# Altium project SAML21_Xplained_Pro.PrjPCB (part 2 of 3)

## Sheet SAML21_Xplained_Pro_triple_input_power_supply.SchDoc: Power supply
size A3; Organization: ATMEL Norway; Address1: Vestre Rosten 79; Address2: N-7075 TILLER; Address3: NORWAY; DocumentNumber: A09-2241; Revision: 4; SheetNumber: 5; SheetTotal: 10; PageSetup: Record=PageOptions|CenterHorizontal=True|CenterVertical=True|PrintScale=1.01|XCorrection=1.00|YCorrection=1.00|PrintKind=1|BorderSize=5000000|LeftOffset=0|BottomOffset=0|Orientation=2|PaperLength=1000|PaperWidth=1000|Scale=100|PaperSource=7|PrintQuality=-4|MediaType=1|DitherType=10|PaperKind=A3 (297 x 420 mm)|PrintScaleMode=1
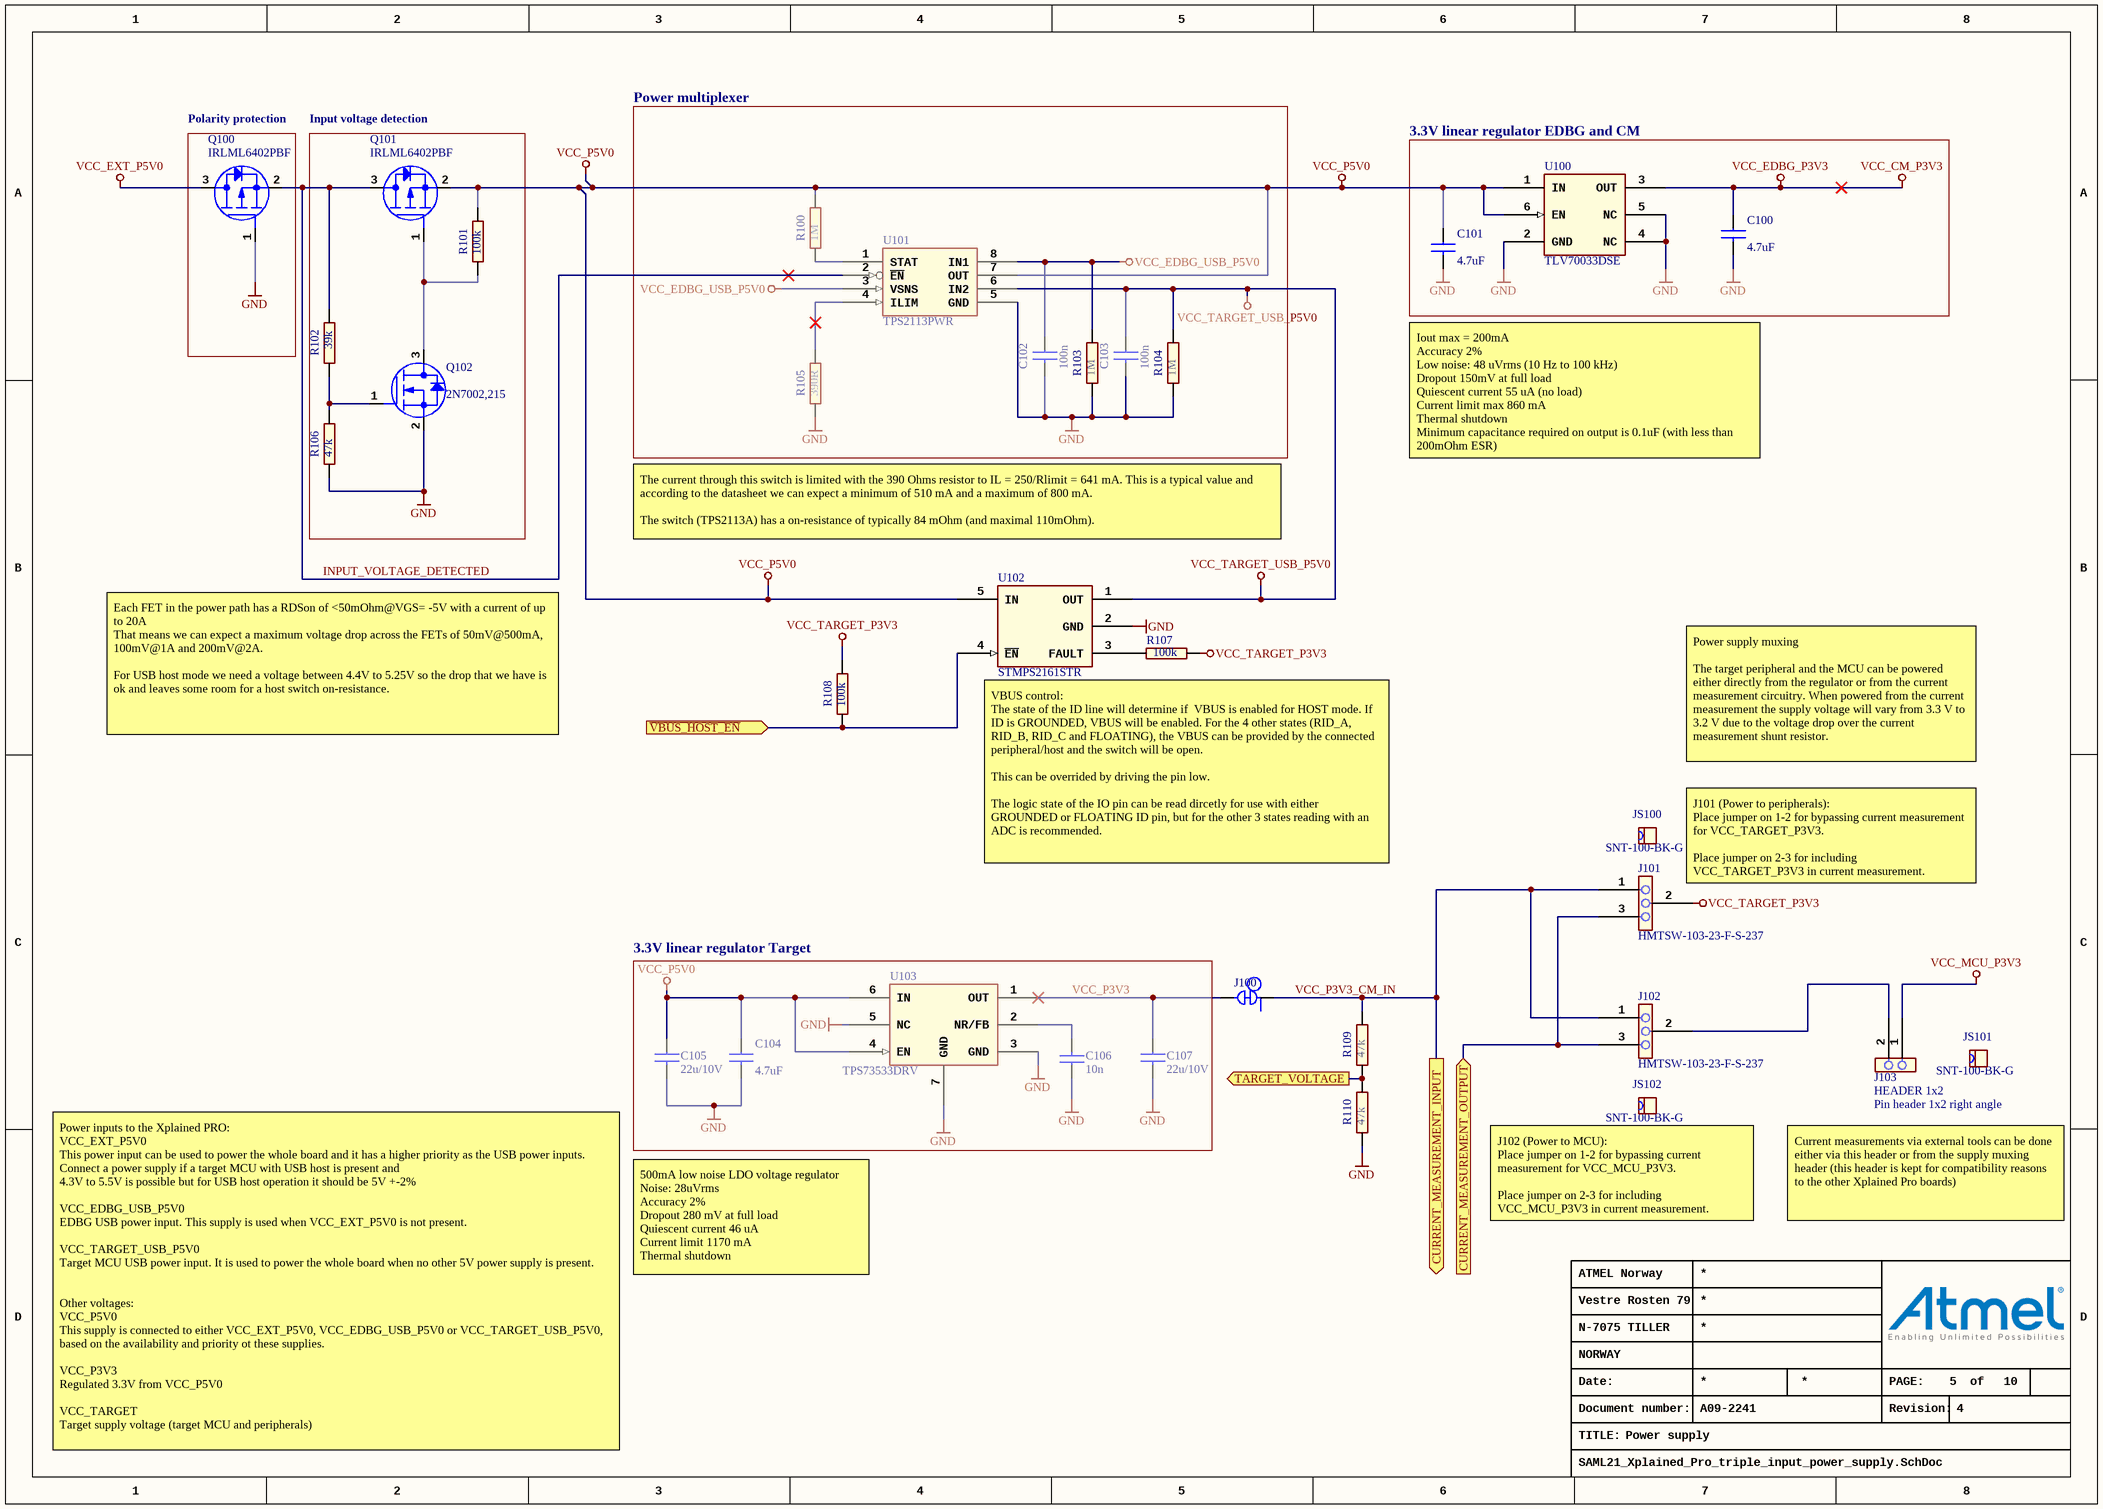
[diagram p4: SAML21_Xplained_Pro_triple_input_power_supply.SchDoc]

### Parts
C100  value 4.7uF  [AP1-00117]  (hidden comment: CAP-NONPOL)
C101  value 4.7uF  [AP1-00117]  (hidden comment: CAP-NONPOL)
C102  value 100n  [AP1-00053]  (hidden comment: CAP-NONPOL)
C103  value 100n  [AP1-00053]  (hidden comment: CAP-NONPOL)
C104  value 4.7uF  [AP1-00117]  (hidden comment: CAP-NONPOL)
C105  value 22u/10V  [AP1-00003]  (hidden comment: CAP-NONPOL)
C106  value 10n  [AP1-00053]  (hidden comment: CAP-NONPOL)
C107  value 22u/10V  [AP1-00003]  (hidden comment: CAP-NONPOL)
J100  SMD-STRAP_CLOSED  [AP9-00044]  (value not drawn)  (net tie, no BOM)
J101  value HMTSW-103-23-F-S-237  [AP8-00745]  (hidden comment: Same as A08-1614 but with 1mm hole for optimal reflow soldering (no misalignment of the component))
J102  value HMTSW-103-23-F-S-237  [AP8-00745]  (hidden comment: Same as A08-1614 but with 1mm hole for optimal reflow soldering (no misalignment of the component))
J103  HEADER 1x2  value Pin header 1x2 right angle  [AP8-00367]
JS100  value SNT-100-BK-G  [AP8-00525]
JS101  value SNT-100-BK-G  [AP8-00525]
JS102  value SNT-100-BK-G  [AP8-00525]
Q100  value IRLML6402PBF  [AP5-00002]  (hidden comment: MOSFET_P_GSD)
Q101  value IRLML6402PBF  [AP5-00002]  (hidden comment: MOSFET_P_GSD)
Q102  value 2N7002,215  [AP5-00002]  (hidden comment: MOSFET_N_GSD)
R100  value 1M  [AP2-00011]  (hidden comment: R2)
R101  value 100k  [AP2-00011]  (hidden comment: R2)
R102  value 39k  [AP2-00011]  (hidden comment: R2)
R103  value 1M  [AP2-00011]  (hidden comment: R2)
R104  value 1M  [AP2-00011]  (hidden comment: R2)
R105  value 390R  [AP2-00011]  (hidden comment: R2)
R106  value 47k  [AP2-00011]  (hidden comment: R2)
R107  value 100k  [AP2-00011]  (hidden comment: R2)
R108  value 100k  [AP2-00011]  (hidden comment: R2)
R109  value 47k  [AP2-00011]  (hidden comment: R2)
R110  value 47k  [AP2-00011]  (hidden comment: R2)
U100  value TLV70033DSE  [AP6-00262]  (hidden comment: TLV70033)
U101  value TPS2113PWR  [AP6-00054]  (hidden comment: TPS2112)
U102  value STMPS2161STR  [AP6-00087]  (hidden comment: STMPS2161)
U103  value TPS73533DRV  [AP6-00162]  (hidden comment: TPS735xxDRV)

### Blocks framed on the sheet
Power multiplexer: C102 C103 R100 R103-R105 U101
Polarity protection: Q100
Input voltage detection: Q101 Q102 R101 R102 R106
3.3V linear regulator EDBG and CM: C100 C101 U100
3.3V linear regulator Target: C104-C107 U103

### Ports
CURRENT_MEASUREMENT_INPUT (out), CURRENT_MEASUREMENT_OUTPUT (in), TARGET_VOLTAGE (out), ~{VBUS_HOST_EN} (in)

### Nets
GND: C100.2 C101.2 C102.2 C103.2 C104.2 C105.2 C106.1 C107.2 Q100.1(G) Q102.2(S) R103.1 R104.1 R105.1 R106.1 R110.1 U100.2(GND) U100.4(NC) U100.5(NC) U101.5(GND) U102.2(GND) U103.3(GND) U103.5(NC) U103.7(GND)
VCC_CM_P3V3: C100.1 U100.3(OUT)  [also labelled VCC_EDBG_P3V3]
VCC_EDBG_USB_P5V0: C102.1 R103.2 U101.3(VSNS) U101.8(IN1)
VCC_EXT_P5V0: Q100.3(D)
VCC_MCU_P3V3: J103.1
VCC_P5V0: C101.1 C104.1 C105.1 Q101.2(S) R100.2 R101.2 U100.1(IN) U100.6(EN) U101.7(OUT) U102.5(IN) U103.4(EN) U103.6(IN)
VCC_TARGET_P3V3: J101.2 R107.1 R108.2
VCC_TARGET_USB_P5V0: C103.1 R104.2 U101.6(IN2) U102.1(OUT)
CM_PA09_AIN17: R109.1 R110.2 ; port TARGET_VOLTAGE
INPUT_VOLTAGE_DETECTED: Q100.2(S) Q101.3(D) R102.2 U101.2(~{EN})
TARGET_USB_ID: R108.1 U102.4(~{EN}) ; port ~{VBUS_HOST_EN}
VCC_P3V3: C107.1 J100.2 U103.1(OUT)
VCC_P3V3_CM_IN: J100.1 J101.1 J102.1 R109.2 ; port CURRENT_MEASUREMENT_INPUT
NetC106_2: C106.2 U103.2(NR/FB)
NetJ101_3: J101.3 J102.3 ; port CURRENT_MEASUREMENT_OUTPUT
NetJ102_2: J102.2 J103.2
NetQ101_1: Q101.1(G) Q102.3(D) R101.1
NetQ102_1: Q102.1(G) R102.1 R106.2
NetR100_1: R100.1 U101.1(STAT)
NetR105_2: R105.2 U101.4(ILIM)
NetR107_2: R107.2 U102.3(FAULT)

### Notes on the sheet
- Iout max = 200mA
  Accuracy 2%
  Low noise: 48 uVrms (10 Hz to 100 kHz)
  Dropout 150mV at full load
  Quiescent current 55 uA (no load)
  Current limit max 860 mA
  Thermal shutdown
  Minimum capacitance required on output is 0.1uF (with less than 200mOhm ESR)
- The current through this switch is limited with the 390 Ohms resistor to IL = 250/Rlimit = 641 mA. This is a typical value and according to the datasheet we can expect a minimum of 510 mA and a maximum of 800 mA.
  The switch (TPS2113A) has a on-resistance of typically 84 mOhm (and maximal 110mOhm).
- Each FET in the power path has a RDSon of <50mOhm@VGS= -5V with a current of up to 20A
  That means we can expect a maximum voltage drop across the FETs of 50mV@500mA, 100mV@1A and 200mV@2A.
  For USB host mode we need a voltage between 4.4V to 5.25V so the drop that we have is ok and leaves some room for a host switch on-resistance.
- Power supply muxing
  The target peripheral and the MCU can be powered either directly from the regulator or from the current measurement circuitry. When powered from the current measurement the supply voltage will vary from 3.3 V to 3.2 V due to the voltage drop over the current measurement shunt resistor.
- VBUS control:
  The state of the ID line will determine if  VBUS is enabled for HOST mode. If ID is GROUNDED, VBUS will be enabled. For the 4 other states (RID_A,  RID_B, RID_C and FLOATING), the VBUS can be provided by the connected peripheral/host and the switch will be open.
  This can be overrided by driving the pin low.
  The logic state of the IO pin can be read dircetly for use with either GROUNDED or FLOATING ID pin, but for the other 3 states reading with an ADC is recommended.
- J101 (Power to peripherals):
  Place jumper on 1-2 for bypassing current measurement for VCC_TARGET_P3V3.
  Place jumper on 2-3 for including VCC_TARGET_P3V3 in current measurement.
- (near JS102) J102 (Power to MCU):
  Place jumper on 1-2 for bypassing current measurement for VCC_MCU_P3V3.
  Place jumper on 2-3 for including VCC_MCU_P3V3 in current measurement.
- Current measurements via external tools can be done either via this header or from the supply muxing header (this header is kept for compatibility reasons to the other Xplained Pro boards)
- 500mA low noise LDO voltage regulator
  Noise: 28uVrms
  Accuracy 2%
  Dropout 280 mV at full load
  Quiescent current 46 uA
  Current limit 1170 mA
  Thermal shutdown
- Power inputs to the Xplained PRO:
  VCC_EXT_P5V0
  This power input can be used to power the whole board and it has a higher priority as the USB power inputs. Connect a power supply if a target MCU with USB host is present and
  4.3V to 5.5V is possible but for USB host operation it should be 5V +-2%
  VCC_EDBG_USB_P5V0
  EDBG USB power input. This supply is used when VCC_EXT_P5V0 is not present.
  VCC_TARGET_USB_P5V0
  Target MCU USB power input. It is used to power the whole board when no other 5V power supply is present.
  Other voltages:
  VCC_P5V0
  This supply is connected to either VCC_EXT_P5V0, VCC_EDBG_USB_P5V0 or VCC_TARGET_USB_P5V0, based on the availability and priority ot these supplies.
  VCC_P3V3
  Regulated 3.3V from VCC_P5V0
  VCC_TARGET
  Target supply voltage (target MCU and peripherals)
- Date:
- PAGE:
- of
- TITLE:
- Document number:
- Revision:

### Library data of the parts
C100 C101 C104 = A01-0377: as C305 on sheet SAML21_Xplained_Pro_Target_MCU; AN: A01-0377; Tolerance: 10%; Height: 0.800000011920929
C102 C103 = A01-0246: as C304 on sheet SAML21_Xplained_Pro_Target_MCU; AN: A01-0246; Tolerance: 16V, +/-10%; Height: 0.5
C105 C107 = A01-0500: Ceramic capacitor, SMD 0805, X5R, 10V, Â±20%; PartGroup: Capacitors,Ceramic,SMD 0805; Manufacturer: tdk; MPN: C2012X5R1A226M/0.85; TemperatureRange: -55Â°C to +85Â°C; AN: A01-0500; Height: 0.949999988079071
C106 = A01-0050: Ceramic capacitor, SMD 0402, X7R, 25V, +/-10%; PartGroup: Capacitors,Ceramic,SMD 0402; TemperatureRange: -55 - +125 deg C; AN: A01-0050; Tolerance: 25V, +/-10%; Height: 0.550000011920929
J100 = A09-0783: as J300 on sheet SAML21_Xplained_Pro_Target_MCU; AN: A09-0783; Height: 0
J101 J102 = A08-1799: 1x3 pin header, 2.54mm pitch, Pin-in-Paste THM, 1mm hole; PartGroup: Mechanical devices,Connectors,Pin headers; Manufacturer: SAMTEC; AN: A08-1799; Height: 6,09999990463257; MPN: HMTSW-103-23-F-S-237
J103 = A08-0764: 1x2 pin header, right angle, 2.54 mm pitch, through-hole; PartGroup: Mechanical devices,Connectors,Pin headers; Manufacturer: Pro-data International Corp; MPN: 2213R-2G; AN: A08-0764; Height: 2.53999996185303
JS100-JS102 = A08-0543: Jumper cap for 2.54mm pinheader; PartGroup: Mechanical devices,Mounting accessories,Other; Manufacturer: SAMTEC; AN: A08-0543; MPN: SNT-100-BK-G
Q100 Q101 = A05-0087: P-ch. MOSFET. -30V, -3.7A continuous,RDS(ON)=0.05Ohm@VGS=-4,5V, RDS(ON)=0.08Ohm@VGS=-2.5V; PartGroup: Transistors,Power FET,SMD; Manufacturer: International Rectifier; TemperatureRange: -55 - +150 deg C; AN: A05-0087; Height: 1.14999997615814; MPN: IRLML6402PBF
Q102 = A05-0085: N-Channel MOSFET. 60V, 0.300A continuous, 1.2A Peak. RDS(ON) = 3.8Ohm@VGS=4.5V, VGS(th)<2.5V; PartGroup: Transistors,Small signal FET,SMD; Manufacturer: NXP; TemperatureRange: -65 to 150 deg C; AN: A05-0085; Height: 1.10000002384186; MPN: 2N7002,215
R100 R103 R104 = A02-0284: Thick film resistor, SMD 0402, 1/16W, 1%; PartGroup: Resistors,SMD,0402 1%; TemperatureRange: -55 - +125 deg C; AN: A02-0284; Tolerance: 1 %; Height: 0.349999994039536
R101 R107 R108 = A02-0260: Thick film resistor, SMD 0402, 1/16W, 1%; PartGroup: Resistors,SMD,0402 1%; TemperatureRange: -55 - +125 deg C; AN: A02-0260; Tolerance: 1 %; Height: 0.349999994039536
R102 = A02-0250: Thick film resistor, SMD 0402, 1/16W, 1%; PartGroup: Resistors,SMD,0402 1%; TemperatureRange: -55 - +125 deg C; AN: A02-0250; Tolerance: 1 %; Height: 0.349999994039536
R105 = A02-0202: Thick film resistor, SMD 0402, 1/16W, 1%; PartGroup: Resistors,SMD,0402 1%; TemperatureRange: -55 - +125 deg C; AN: A02-0202; Tolerance: 1 %; Height: 0.349999994039536
R106 R109 R110 = A02-0252: as R201 on sheet SAML21_Xplained_Pro_Connectors; AN: A02-0252; Tolerance: 1 %; Height: 0.349999994039536
U100 = A06-0719: LDO, 200 mA, Iq=31 uA, Vdo=250mV, Vout=3.3V, VIN= 2 V to 5.5V, SON-6 package; PartGroup: Integrated Circuits,Regulators,Linear; Manufacturer: Texas Instruments; AN: A06-0719; Height: 0.800000011920929; MPN: TLV70033DSE
U101 = A06-0068: Autoswitching 2:1 Power Mux; PartGroup: Integrated Circuits,General linear,Analog switch, bus switch and MUX; Manufacturer: Texas Instruments; TemperatureRange: -40 - + 125 deg C; AN: A06-0068; Height: 1.20000004768372; MPN: TPS2113PWR
U102 = A06-1087: Single channel power switch, 1A, reverse block, active low enabled.; PartGroup: Integrated Circuits,General linear,Analog switch, bus switch and MUX; Tolerance: 2.7 to 5.5V; TemperatureRange: -40Â°C to +85Â°C; Design comment: *; AN: A06-1087; Height: 1,45000004768372
U103 = A06-1135: Low noise LDO, 500 mA, Vout=3.3V, 2% accuracy, IQ=46uA, noise=28uVrms, VIN= 2.7V to 6.5V, Vdo=280mV,stable with low ESR capacitor; PartGroup: Integrated Circuits,Regulators,Linear; Manufacturer: Texas Instruments; AN: A06-1135; Height: 0.75; MPN: TPS73533DRV

## Sheet SAML21_Xplained_Pro_current_measurement.SchDoc: Current measurement
size A3; Organization: ATMEL Norway; Address1: Vestre Rosten 79; Address2: N-7075 TILLER; Address3: NORWAY; DocumentNumber: A09-2241; Revision: 4; SheetNumber: 6; SheetTotal: 10; PageSetup: Record=PageOptions|CenterHorizontal=True|CenterVertical=True|PrintScale=1.01|XCorrection=1.00|YCorrection=1.00|PrintKind=1|BorderSize=5000000|LeftOffset=0|BottomOffset=0|Orientation=2|PaperLength=1000|PaperWidth=1000|Scale=100|PaperSource=7|PrintQuality=-4|MediaType=1|DitherType=10|PaperKind=A3 (297 x 420 mm)|PrintScaleMode=1
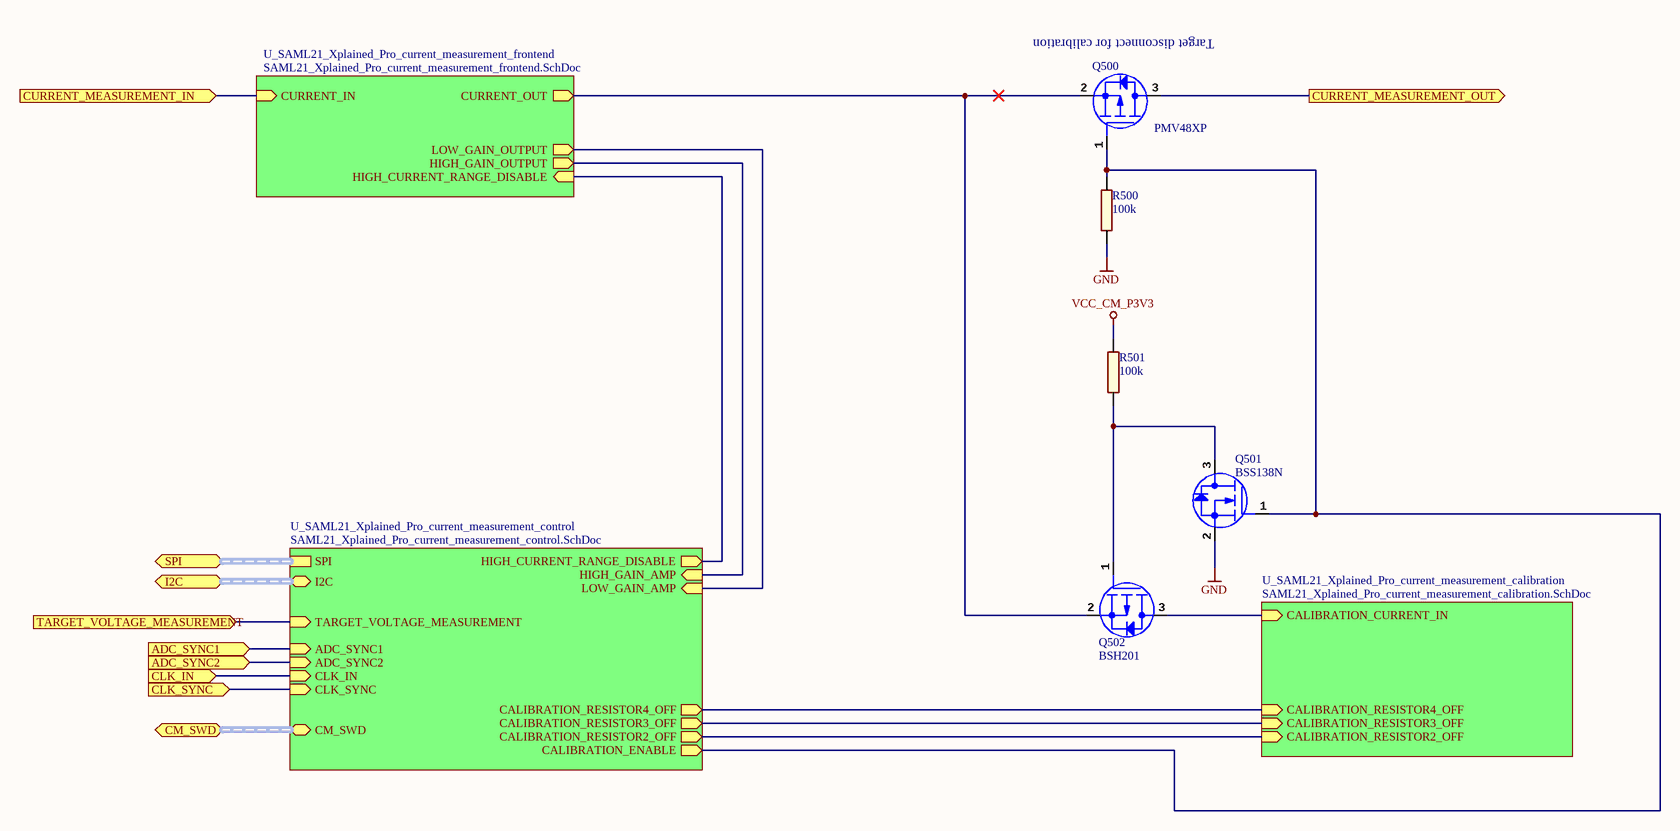
[diagram p5: SAML21_Xplained_Pro_current_measurement.SchDoc]

### Parts
Q500  value PMV48XP  [AP5-00002]  (hidden comment: MOSFET_P_GSD)
Q501  value BSS138N  [AP5-00002]  (hidden comment: MOSFET_N_GSD)
Q502  value BSH201  [AP5-00002]  (hidden comment: MOSFET_P_GSD)
R500  value 100k  [AP2-00011]  (hidden comment: R2)
R501  value 100k  [AP2-00011]  (hidden comment: R2)

### Sub-sheets
U_SAML21_Xplained_Pro_current_measurement_calibration = SAML21_Xplained_Pro_current_measurement_calibration.SchDoc: CALIBRATION_RESISTOR2_OFF (in), CALIBRATION_RESISTOR3_OFF (in), CALIBRATION_RESISTOR4_OFF (in), CALIBRATION_CURRENT_IN (in)
U_SAML21_Xplained_Pro_current_measurement_control = SAML21_Xplained_Pro_current_measurement_control.SchDoc: LOW_GAIN_AMP (in), HIGH_GAIN_AMP (in), HIGH_CURRENT_RANGE_DISABLE (out), SPI (harness SPI), CALIBRATION_RESISTOR3_OFF (out), CALIBRATION_RESISTOR2_OFF (out), CALIBRATION_ENABLE (out), CALIBRATION_RESISTOR4_OFF (out), I2C (harness I2C), ADC_SYNC1 (in), ADC_SYNC2 (in), CLK_IN (in), CLK_SYNC (in), TARGET_VOLTAGE_MEASUREMENT (in), CM_SWD (harness SWD)
U_SAML21_Xplained_Pro_current_measurement_frontend = SAML21_Xplained_Pro_current_measurement_frontend.SchDoc: CURRENT_OUT (out), CURRENT_IN (in), LOW_GAIN_OUTPUT (out), HIGH_GAIN_OUTPUT (out), HIGH_CURRENT_RANGE_DISABLE (in)

### Ports
ADC_SYNC1 (in), ADC_SYNC2 (in), CLK_IN (in), CLK_SYNC (in), CM_SWD (harness SWD), CURRENT_MEASUREMENT_IN (in), CURRENT_MEASUREMENT_OUT (out), I2C (harness I2C), SPI (harness SPI), TARGET_VOLTAGE_MEASUREMENT (in)

### Nets
GND: Q501.2(S) R500.1
VCC_CM_P3V3: R501.2
CM_PA00_GPIO: sheet U_SAML21_Xplained_Pro_current_measurement_calibration/CALIBRATION_RESISTOR3_OFF, sheet U_SAML21_Xplained_Pro_current_measurement_control/CALIBRATION_RESISTOR3_OFF
CM_PA01_GPIO: sheet U_SAML21_Xplained_Pro_current_measurement_calibration/CALIBRATION_RESISTOR4_OFF, sheet U_SAML21_Xplained_Pro_current_measurement_control/CALIBRATION_RESISTOR4_OFF
CM_PA05_AIN5: sheet U_SAML21_Xplained_Pro_current_measurement_control/LOW_GAIN_AMP, sheet U_SAML21_Xplained_Pro_current_measurement_frontend/LOW_GAIN_OUTPUT
CM_PA08_AIN16: sheet U_SAML21_Xplained_Pro_current_measurement_control/HIGH_GAIN_AMP, sheet U_SAML21_Xplained_Pro_current_measurement_frontend/HIGH_GAIN_OUTPUT
CM_PA09_AIN17: port TARGET_VOLTAGE_MEASUREMENT, sheet U_SAML21_Xplained_Pro_current_measurement_control/TARGET_VOLTAGE_MEASUREMENT
CM_PA10_GPIO: Q500.1(G) Q501.1(G) R500.2 ; sheet U_SAML21_Xplained_Pro_current_measurement_control/CALIBRATION_ENABLE
CM_PA11_GCLK5: port CLK_SYNC, sheet U_SAML21_Xplained_Pro_current_measurement_control/CLK_SYNC
CM_PA14_GCLK0: port CLK_IN, sheet U_SAML21_Xplained_Pro_current_measurement_control/CLK_IN
CM_PA15_GPIO: sheet U_SAML21_Xplained_Pro_current_measurement_calibration/CALIBRATION_RESISTOR2_OFF, sheet U_SAML21_Xplained_Pro_current_measurement_control/CALIBRATION_RESISTOR2_OFF
CM_PA18_CMP0: sheet U_SAML21_Xplained_Pro_current_measurement_control/HIGH_CURRENT_RANGE_DISABLE, sheet U_SAML21_Xplained_Pro_current_measurement_frontend/HIGH_CURRENT_RANGE_DISABLE
PA16_GPIO_IRQ: port ADC_SYNC2, sheet U_SAML21_Xplained_Pro_current_measurement_control/ADC_SYNC2
PB01_ADC9: port ADC_SYNC1, sheet U_SAML21_Xplained_Pro_current_measurement_control/ADC_SYNC1
VCC_P3V3_CM_IN: port CURRENT_MEASUREMENT_IN, sheet U_SAML21_Xplained_Pro_current_measurement_frontend/CURRENT_IN
NetJ101_3: Q500.3(D) ; port CURRENT_MEASUREMENT_OUT
NetQ500_2: Q500.2(S) Q502.2(S) ; sheet U_SAML21_Xplained_Pro_current_measurement_frontend/CURRENT_OUT
NetQ501_3: Q501.3(D) Q502.1(G) R501.1
NetQ502_3: Q502.3(D) ; sheet U_SAML21_Xplained_Pro_current_measurement_calibration/CALIBRATION_CURRENT_IN

### Buses and harness runs
harness port CM_SWD = sheet U_SAML21_Xplained_Pro_current_measurement_control/CM_SWD
harness port I2C = sheet U_SAML21_Xplained_Pro_current_measurement_control/I2C
harness port SPI = sheet U_SAML21_Xplained_Pro_current_measurement_control/SPI

### Notes on the sheet
- (near Q500) Target disconnect for calibration
- Date:
- PAGE:
- of
- TITLE:
- Document number:
- Revision:

### Library data of the parts
Q500 = A05-0130: P-Channel Digital FET. -30V, -3.5A continuous, -14A Peak. RDS(ON)=48mOhm@VGS=-4.5V, RDS(ON)=71mOhm@VGS=-2.5V. VGS(th)<1.25V; PartGroup: Transistors,Power FET,SMD; Manufacturer: NXP; MPN: PMV48XP,215; TemperatureRange: -55Â°C to +150Â°C; AN: A05-0130
Q501 = A05-0140: Low leakage N-Channel MOSFET. 60V, 0.23A continuous, 0.92A Peak. RDS(ON) = 3.5Ohm@VGS=4.5V, VGS(th)<1.4V; PartGroup: Transistors,Small signal FET,SMD; Manufacturer: Infineon; TemperatureRange: -55  to +150 deg celcius; AN: A05-0140; Height: 1.10000002384186; MPN: BSS138N
Q502 = A05-0132: P-Channel Digital FET. -60V, -0.3A continuous, -1.2A Peak. RDS(ON)=2.5@VGS=-10V, RDS(ON)=<5 ohm @VGS=-2.5V. VGS(th)<1.9V; PartGroup: Transistors,Small signal FET,SMD; Manufacturer: NXP; MPN: BSH201,215; AN: A05-0132
R500 R501 = A02-0260: Thick film resistor, SMD 0402, 1/16W, 1%; PartGroup: Resistors,SMD,0402 1%; TemperatureRange: -55ï¿½ to +125ï¿½C; AN: A02-0260; Tolerance: 1 %; Height: 0,349999994039536

## Sheet SAML21_Xplained_Pro_current_measurement_calibration.SchDoc: Current measurement calibration
size A3; Organization: ATMEL Norway; Address1: Vestre Rosten 79; Address2: N-7075 TILLER; Address3: NORWAY; DocumentNumber: A09-2241; Revision: 4; SheetNumber: 9; SheetTotal: 10; PageSetup: Record=PageOptions|CenterHorizontal=True|CenterVertical=True|PrintScale=1.01|XCorrection=1.00|YCorrection=1.00|PrintKind=1|BorderSize=5000000|LeftOffset=0|BottomOffset=0|Orientation=2|PaperLength=1000|PaperWidth=1000|Scale=100|PaperSource=7|PrintQuality=-4|MediaType=1|DitherType=10|PaperKind=A3 (297 x 420 mm)|PrintScaleMode=1
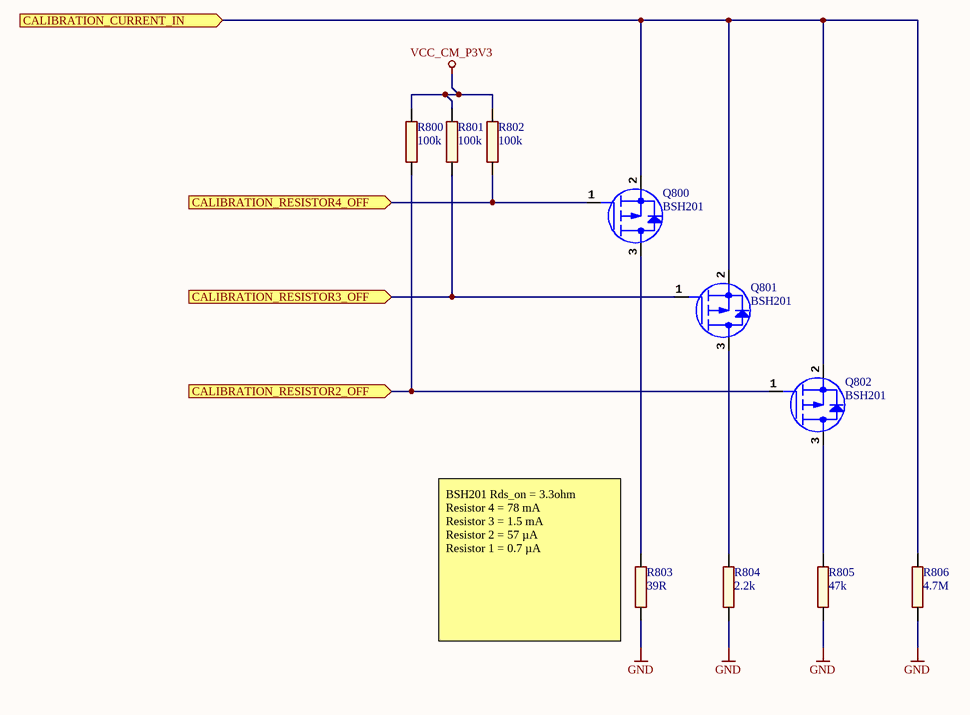
[diagram p6: SAML21_Xplained_Pro_current_measurement_calibration.SchDoc]

### Parts
Q800  value BSH201  [AP5-00002]  (hidden comment: MOSFET_P_GSD)
Q801  value BSH201  [AP5-00002]  (hidden comment: MOSFET_P_GSD)
Q802  value BSH201  [AP5-00002]  (hidden comment: MOSFET_P_GSD)
R800  value 100k  [AP2-00011]  (hidden comment: R2)
R801  value 100k  [AP2-00011]  (hidden comment: R2)
R802  value 100k  [AP2-00011]  (hidden comment: R2)
R803  value 39R  [AP2-00011]  (hidden comment: R2)
R804  value 2.2k  [AP2-00011]  (hidden comment: R2)
R805  value 47k  [AP2-00011]  (hidden comment: R2)
R806  value 4.7M  [AP2-00011]  (hidden comment: R2)

### Ports
CALIBRATION_CURRENT_IN (in), CALIBRATION_RESISTOR2_OFF (in), CALIBRATION_RESISTOR3_OFF (in), CALIBRATION_RESISTOR4_OFF (in)

### Nets
GND: R803.1 R804.1 R805.1 R806.1
VCC_CM_P3V3: R800.2 R801.2 R802.2
CM_PA00_GPIO: Q801.1(G) R801.1 ; port CALIBRATION_RESISTOR3_OFF
CM_PA01_GPIO: Q800.1(G) R802.1 ; port CALIBRATION_RESISTOR4_OFF
CM_PA15_GPIO: Q802.1(G) R800.1 ; port CALIBRATION_RESISTOR2_OFF
NetQ502_3: Q800.2(S) Q801.2(S) Q802.2(S) R806.2 ; port CALIBRATION_CURRENT_IN
NetQ800_3: Q800.3(D) R803.2
NetQ801_3: Q801.3(D) R804.2
NetQ802_3: Q802.3(D) R805.2

### Notes on the sheet
- (near R803) BSH201 Rds_on = 3.3ohm
  Resistor 4 = 78 mA
  Resistor 3 = 1.5 mA
  Resistor 2 = 57 µA
  Resistor 1 = 0.7 µA
- Date:
- PAGE:
- of
- TITLE:
- Document number:
- Revision:

### Library data of the parts
Q800-Q802 = A05-0132: as Q502 on sheet SAML21_Xplained_Pro_current_measurement; AN: A05-0132
R800-R802 = A02-0260: as R500 on sheet SAML21_Xplained_Pro_current_measurement; AN: A02-0260; Tolerance: 1 %; Height: 0,349999994039536
R803 = A02-0178: Thick film resistor, SMD 0402, 1/16W, 1%; PartGroup: Resistors,SMD,0402 1%; TemperatureRange: -55 - +125 deg C; AN: A02-0178; Tolerance: 1 %; Height: 0,349999994039536
R804 = A02-0220: Thick film resistor, SMD 0402, 1/16W, 1%; PartGroup: Resistors,SMD,0402 1%; TemperatureRange: -55 - +125 deg C; AN: A02-0220; Tolerance: 1 %; Height: 0.349999994039536
R805 = A02-0252: Thick film resistor, SMD 0402, 1/16W, 1%; PartGroup: Resistors,SMD,0402 1%; TemperatureRange: -55 - +125 deg C; AN: A02-0252; Tolerance: 1 %; Height: 0.349999994039536
R806 = A02-0884: Thick film SMD 0402 1/16W 1%; PartGroup: Resistors,SMD,0402 1%; TemperatureRange: -55 Â°C to +155 Â°C; AN: A02-0884; Tolerance: 1 %

## Sheet SAML21_Xplained_Pro_current_measurement_control.SchDoc: Current measurement control
size A3; Organization: ATMEL Norway; Address1: Vestre Rosten 79; Address2: N-7075 TILLER; Address3: NORWAY; DocumentNumber: A09-2241; Revision: 4; SheetNumber: 7; SheetTotal: 10; PageSetup: Record=PageOptions|CenterHorizontal=True|CenterVertical=True|PrintScale=1.01|XCorrection=1.00|YCorrection=1.00|PrintKind=1|BorderSize=5000000|LeftOffset=0|BottomOffset=0|Orientation=2|PaperLength=1000|PaperWidth=1000|Scale=100|PaperSource=7|PrintQuality=-4|MediaType=1|DitherType=10|PaperKind=A3 (297 x 420 mm)|PrintScaleMode=1
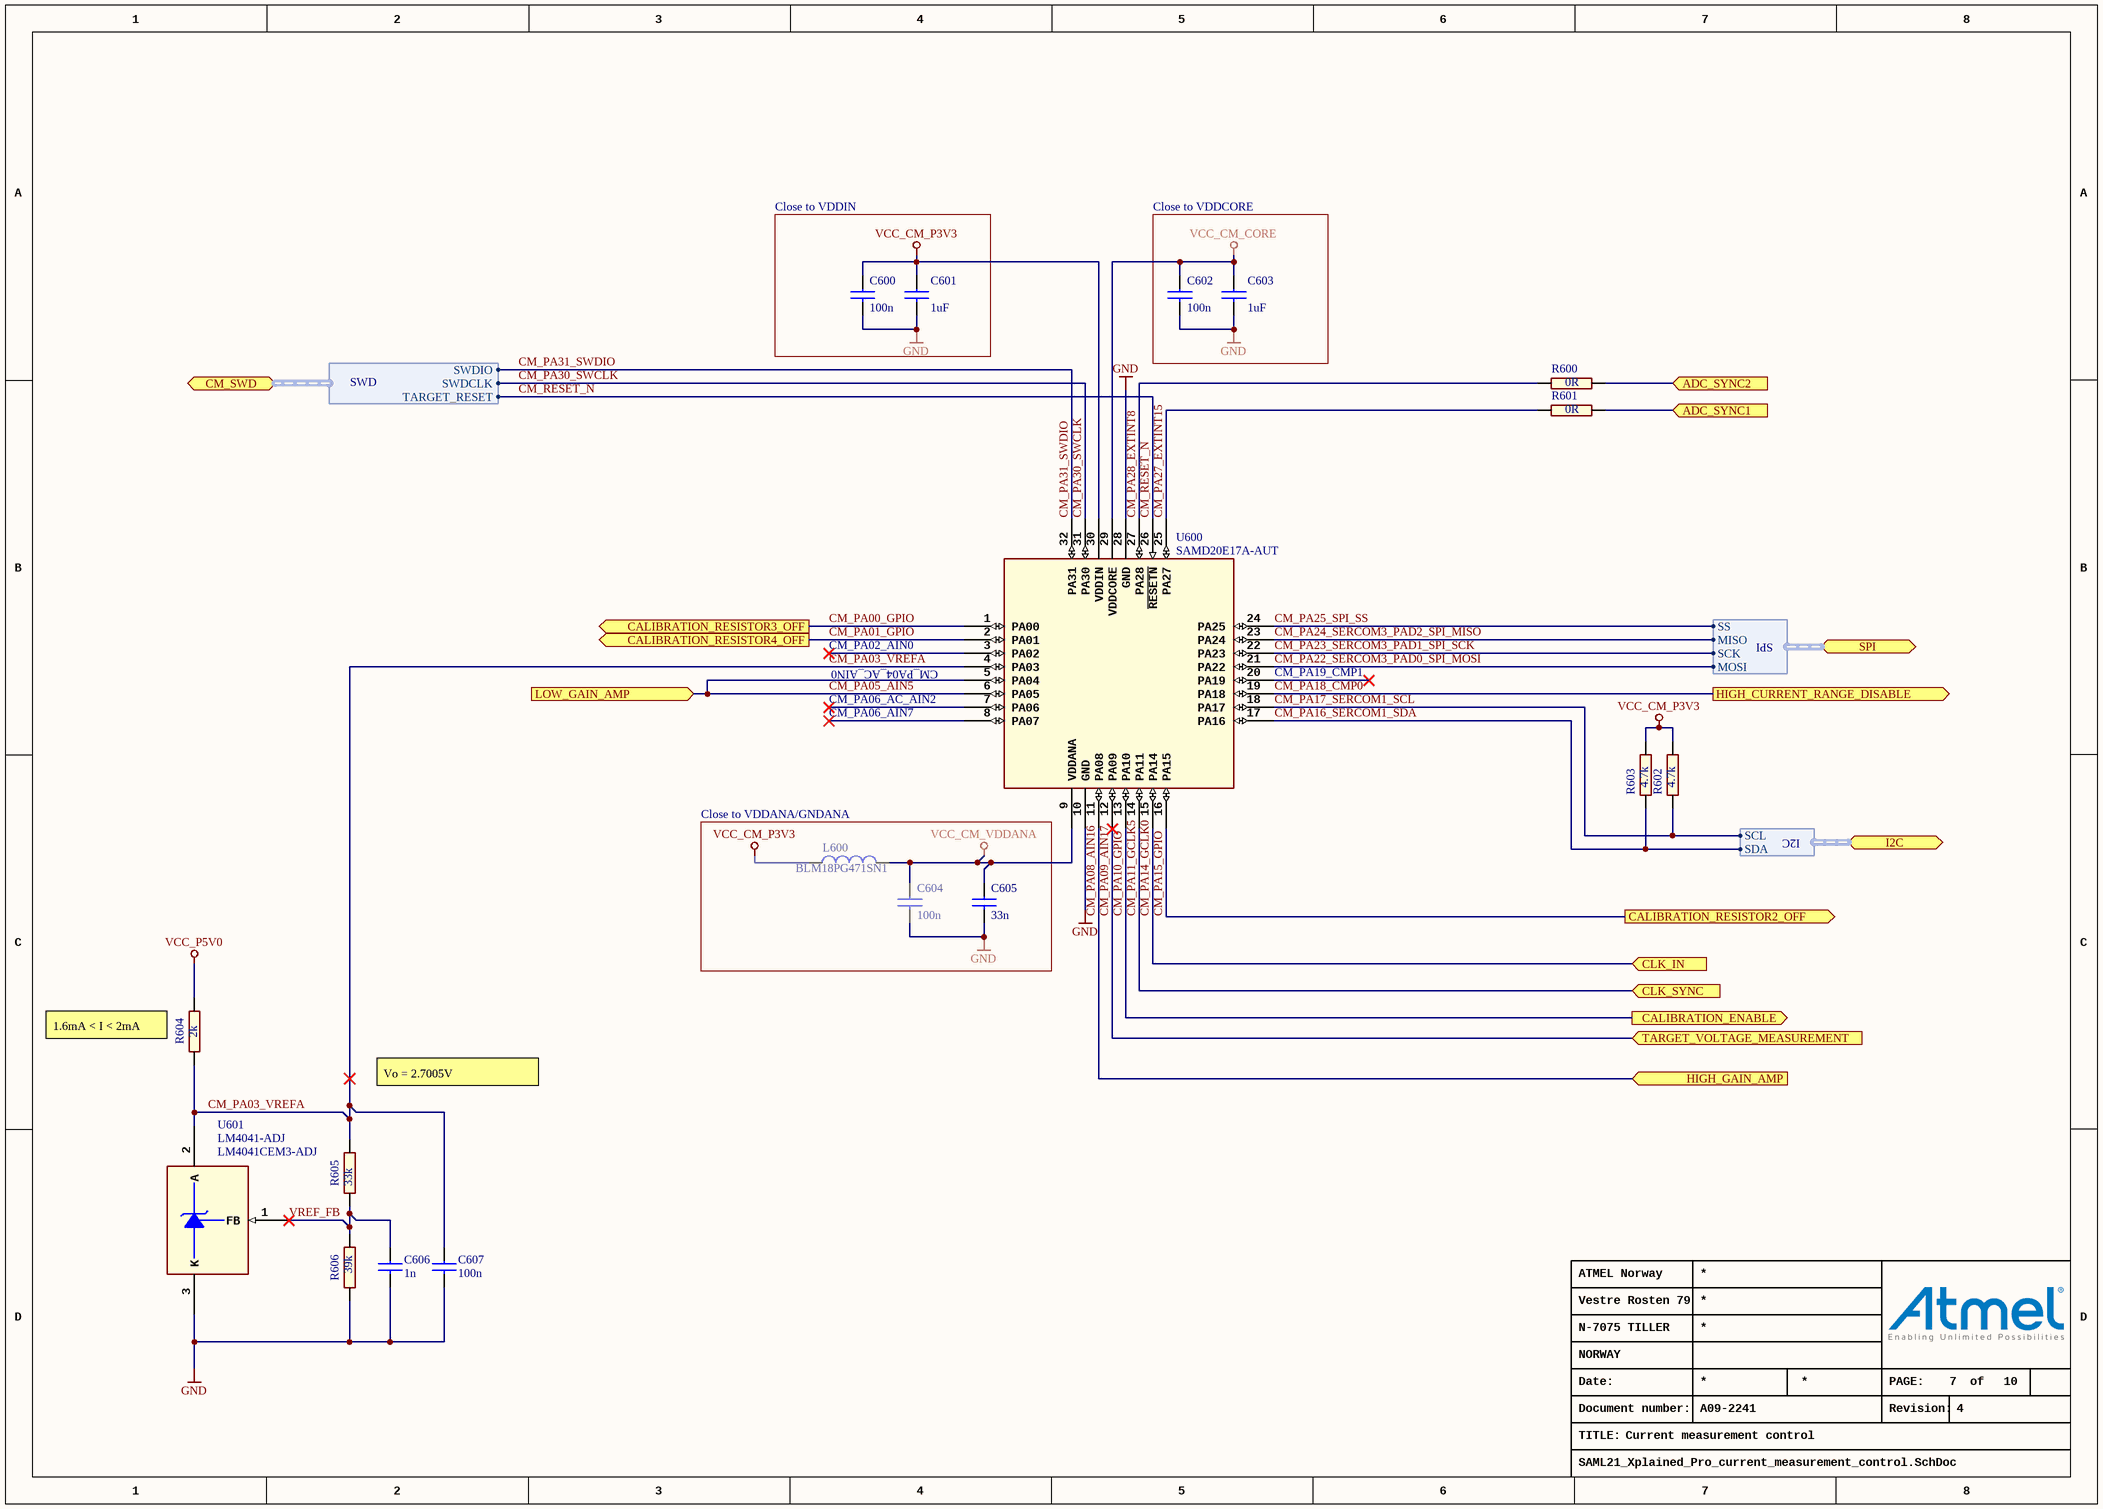
[diagram p7: SAML21_Xplained_Pro_current_measurement_control.SchDoc]

### Parts
C600  value 100n  [AP1-00053]  (hidden comment: CAP-NONPOL)
C601  value 1uF  [AP1-00117]  (hidden comment: CAP-NONPOL)
C602  value 100n  [AP1-00053]  (hidden comment: CAP-NONPOL)
C603  value 1uF  [AP1-00117]  (hidden comment: CAP-NONPOL)
C604  value 100n  [AP1-00053]  (hidden comment: CAP-NONPOL)
C605  value 33n  [AP1-00053]  (hidden comment: CAP-NONPOL)
C606  value 1n  [AP1-00053]  (hidden comment: CAP-NONPOL)
C607  value 100n  [AP1-00053]  (hidden comment: CAP-NONPOL)
L600  BLM18PG471SN1  [AP3-00005]
R600  value 0R  [AP2-00011]  (hidden comment: R2)
R601  value 0R  [AP2-00011]  (hidden comment: R2)
R602  value 4.7k  [AP2-00011]  (hidden comment: R2)
R603  value 4.7k  [AP2-00011]  (hidden comment: R2)
R604  value 2k  [AP2-00011]  (hidden comment: R2)
R605  value 33k  [AP2-00011]  (hidden comment: R2)
R606  value 39k  [AP2-00011]  (hidden comment: R2)
U600  value SAMD20E17A-AUT  [AP6-00061]  (hidden comment: SAMD20E)
U601  LM4041-ADJ  value LM4041CEM3-ADJ  [AP5-00002]

### Blocks framed on the sheet
Close to VDDIN: C600 C601
Close to VDDCORE: C602 C603
Close to VDDANA/GNDANA: C604 C605 L600

### Ports
ADC_SYNC1 (in), ADC_SYNC2 (in), CALIBRATION_ENABLE (out), CALIBRATION_RESISTOR2_OFF (out), CALIBRATION_RESISTOR3_OFF (out), CALIBRATION_RESISTOR4_OFF (out), CLK_IN (in), CLK_SYNC (in), CM_SWD (harness SWD), HIGH_CURRENT_RANGE_DISABLE (out), HIGH_GAIN_AMP (in), I2C (harness I2C), LOW_GAIN_AMP (in), SPI (harness SPI), TARGET_VOLTAGE_MEASUREMENT (in)

### Harnesses
SPI: MISO, MOSI, SCK, SS
I2C: SCL, SDA
SWD: SWDCLK, SWDIO, TARGET_RESET

### Nets
GND: C600.2 C601.2 C602.2 C603.2 C604.2 C605.2 C606.2 C607.2 R606.1 U600.10(GND) U600.28(GND) U601.3(K)
VCC_CM_CORE: C602.1 C603.1 U600.29(VDDCORE)
VCC_CM_P3V3: C600.1 C601.1 L600.1 R602.2 R603.2 U600.30(VDDIN)
VCC_CM_VDDANA: C604.1 C605.1 L600.2 U600.9(VDDANA)
VCC_P5V0: R604.2
CM_PA00_GPIO: U600.1(PA00) ; port CALIBRATION_RESISTOR3_OFF
CM_PA01_GPIO: U600.2(PA01) ; port CALIBRATION_RESISTOR4_OFF
CM_PA03_VREFA: C607.1 R604.1 R605.2 U600.4(PA03) U601.2(A)
CM_PA05_AIN5: U600.5(PA04) U600.6(PA05) ; port LOW_GAIN_AMP
CM_PA08_AIN16: U600.11(PA08) ; port HIGH_GAIN_AMP
CM_PA09_AIN17: U600.12(PA09) ; port TARGET_VOLTAGE_MEASUREMENT
CM_PA10_GPIO: U600.13(PA10) ; port CALIBRATION_ENABLE
CM_PA11_GCLK5: U600.14(PA11) ; port CLK_SYNC
CM_PA14_GCLK0: U600.15(PA14) ; port CLK_IN
CM_PA15_GPIO: U600.16(PA15) ; port CALIBRATION_RESISTOR2_OFF
CM_PA16_SERCOM1_SDA: R603.1 U600.17(PA16) ; port I2C.SDA
CM_PA17_SERCOM1_SCL: R602.1 U600.18(PA17) ; port I2C.SCL
CM_PA18_CMP0: U600.19(PA18) ; port HIGH_CURRENT_RANGE_DISABLE
CM_PA22_SERCOM3_PAD0_SPI_MOSI: U600.21(PA22) ; port SPI.MOSI
CM_PA23_SERCOM3_PAD1_SPI_SCK: U600.22(PA23) ; port SPI.SCK
CM_PA24_SERCOM3_PAD2_SPI_MISO: U600.23(PA24) ; port SPI.MISO
CM_PA25_SPI_SS: U600.24(PA25) ; port SPI.SS
CM_PA27_EXTINT15: R601.1 U600.25(PA27)
CM_PA28_EXTINT8: R600.1 U600.27(PA28)
CM_PA30_SWCLK: U600.31(PA30) ; port CM_SWD.SWDCLK
CM_PA31_SWDIO: U600.32(PA31) ; port CM_SWD.SWDIO
CM_RESET_N: U600.26(~{RESETN}) ; port CM_SWD.TARGET_RESET
PA16_GPIO_IRQ: R600.2 ; port ADC_SYNC2
PB01_ADC9: R601.2 ; port ADC_SYNC1
VREF_FB: C606.1 R605.1 R606.2 U601.1(FB)

Not connected (* = marked no-connect by the designer): U600 3(PA02)* 7(PA06)* 8(PA07)* 20(PA19)*

### Notes on the sheet
- CM_PA02_AIN0
- CM_PA06_AIN7
- CM_PA06_AC_AIN2
- CM_PA04_AC_AIN0
- (near U600) CM_PA19_CMP1
- (near R604) 1.6mA < I < 2mA
- Vo = 2.7005V
- Date:
- PAGE:
- of
- TITLE:
- Document number:
- Revision:

### Library data of the parts
C600 C602 C604 C607 = A01-0246: Ceramic capacitor, SMD 0402, X7R, 16V, +/-10%; PartGroup: Capacitors,Ceramic,SMD 0402; Manufacturer: Kemet; MPN: C0402C104K4RACTU; TemperatureRange: -55 - +125 deg C; AN: A01-0246; Tolerance: 16V, +/-10%; Height: 0,5
C601 C603 = A01-0368: Ceramic capacitor, SMD 0603, X5R, 25V, ±10%; PartGroup: Capacitors,Ceramic,SMD 0603; Manufacturer: Murata; MPN: GRM188R61E105K; AN: A01-0368; Tolerance: ±10%; Height: 0.800000011920929
C605 = A01-0397: Ceramic capacitor, SMD 0402, X7R, 25V, ±10%; PartGroup: Capacitors,Ceramic,SMD 0402; Manufacturer: Murata; MPN: GRM155R71E333KA88D; Tolerance: ±10%(K); TemperatureRange: -55 to 125°C; AN: A01-0397; Height: 0.5
C606 = A01-0038: Ceramic capacitor, SMD 0402, X7R, 50V, +/-10%; PartGroup: Capacitors,Ceramic,SMD 0402; TemperatureRange: -55 - +125 deg C; AN: A01-0038; Tolerance: 50V, +/-10%; Height: 0,550000011920929
L600 = A03-0035: SMD RF inductor 0603. Z=470Ohm (@100MHz), Max R(dc)=0.65Ohm, Max current=1A; PartGroup: Inductors,EMI; Manufacturer: Murata; Tolerance: ±25%; TemperatureRange: -55°C to +125°C; AN: A03-0035; Value: BLM18PG471SN1; Height: 0,800000011920929; MPN: BLM18PG471SN1
R600 R601 = A02-0163: RES 0.0 OHM 1/16W 0402 SMD; PartGroup: Resistors,SMD,0402 1%; Manufacturer: (n/a); MPN: RMCF0402ZT0R00; Tolerance: 1 %; TemperatureRange: -55 - +125 deg C; AN: A02-0163; Height: 0.349999994039536
R602 R603 = A02-0228: Thick film resistor, SMD 0402, 1/16W, 1%; PartGroup: Resistors,SMD,0402 1%; TemperatureRange: -55 - +125 deg C; AN: A02-0228; Tolerance: 1 %; Height: 0.349999994039536
R604 = A02-0219: Thick film resistor, SMD 0402, 1/16W, 1%; PartGroup: Resistors,SMD,0402 1%; TemperatureRange: -55 - +125 deg C; AN: A02-0219; Tolerance: 1 %; Height: 0,349999994039536
R605 = A02-0248: Thick film resistor, SMD 0402, 1/16W, 1%; PartGroup: Resistors,SMD,0402 1%; TemperatureRange: -55 - +125 deg C; AN: A02-0248; Tolerance: 1 %; Height: 0,349999994039536
R606 = A02-0250: Thick film resistor, SMD 0402, 1/16W, 1%; PartGroup: Resistors,SMD,0402 1%; TemperatureRange: -55 - +125 deg C; AN: A02-0250; Tolerance: 1 %; Height: 0,349999994039536
U600 = A06-1023: Atmel 32bit RISC MCU 32 pin; PartGroup: Integrated Circuits,MCU, MPU, DSP,ARM MCU; MPN: ATSAMD20E17A-AUT; Design comment: *; AN: A06-1023; Height: 1.20000004768372; Manufacturer: ATMEL
U601 = A06-0123: Adjustable shunt voltage regulator, 1.24 to 10V out; PartGroup: Integrated Circuits,Regulators,Voltage reference; Manufacturer: National Semiconductor; TemperatureRange: -40 to +85 deg. C; AN: A06-0123; Height: 1; MPN: LM4041CEM3-ADJ

## Sheet SAML21_Xplained_Pro_current_measurement_frontend.SchDoc: Current measurement frontend
size A3; Organization: ATMEL Norway; Address1: Vestre Rosten 79; Address2: N-7075 TILLER; Address3: NORWAY; DocumentNumber: A09-2241; Revision: 4; SheetNumber: 8; SheetTotal: 10; PageSetup: Record=PageOptions|CenterHorizontal=True|CenterVertical=True|PrintScale=1.01|XCorrection=1.00|YCorrection=1.00|PrintKind=1|BorderSize=5000000|LeftOffset=0|BottomOffset=0|Orientation=2|PaperLength=1000|PaperWidth=1000|Scale=100|PaperSource=7|PrintQuality=-4|MediaType=1|DitherType=10|PaperKind=A3 (297 x 420 mm)|PrintScaleMode=1
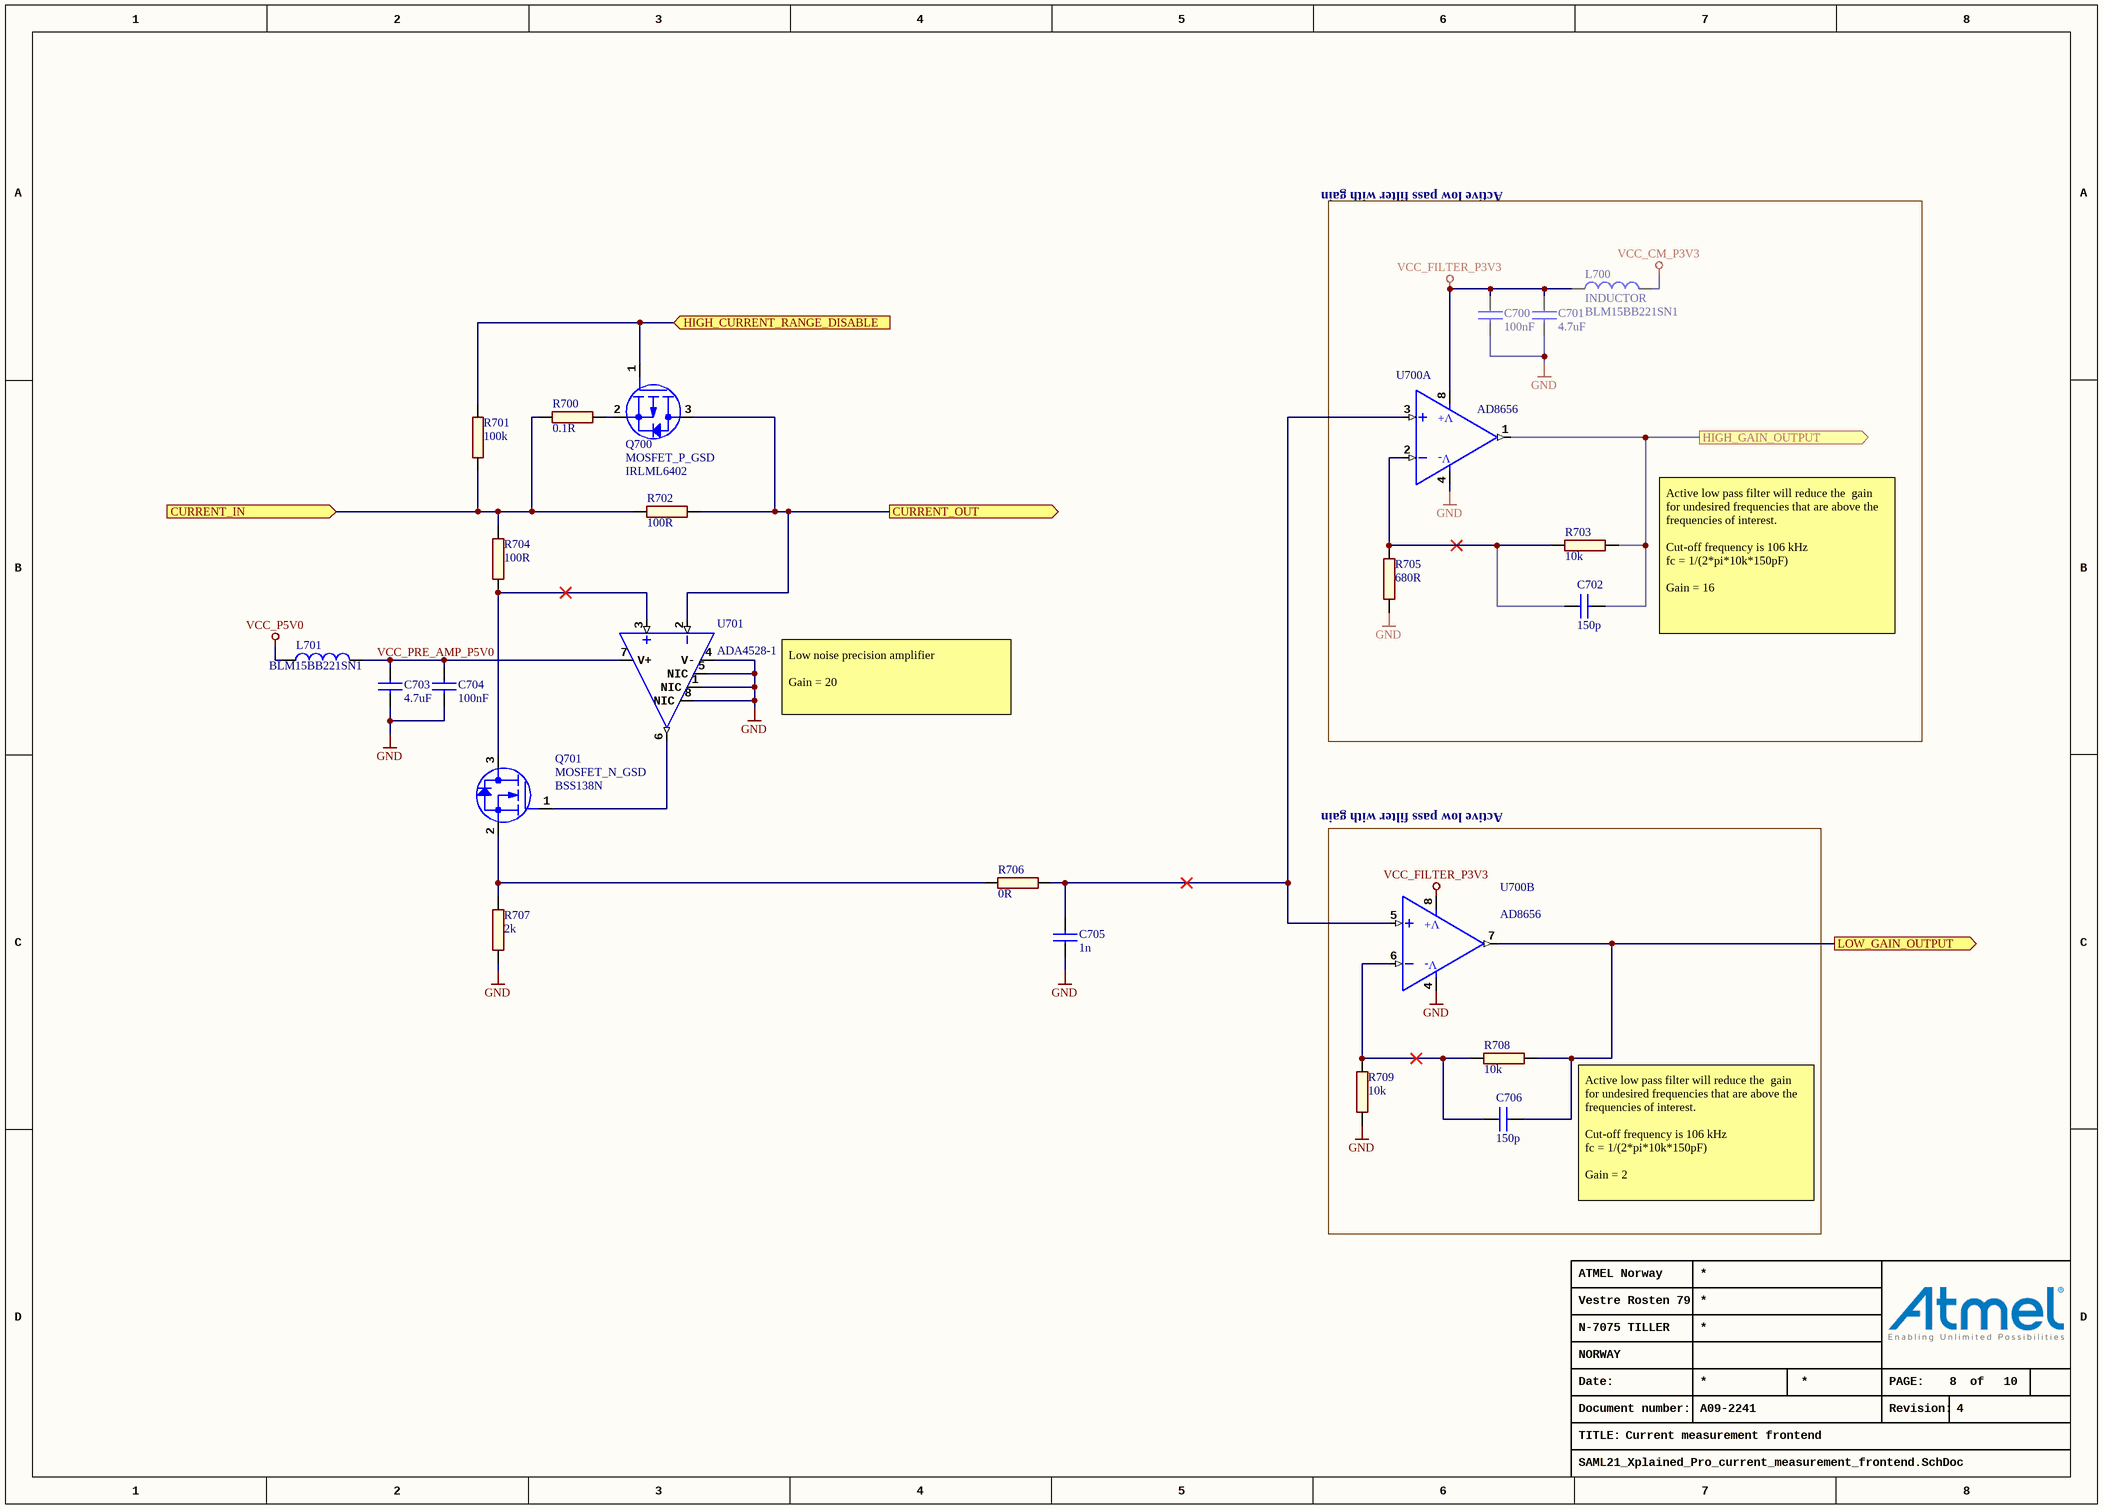
[diagram p8: SAML21_Xplained_Pro_current_measurement_frontend.SchDoc]

### Parts
C700  value 100nF  [AP1-00053]  (hidden comment: CAP-NONPOL)
C701  value 4.7uF  [AP1-00117]  (hidden comment: CAP-NONPOL)
C702  value 150p  [AP1-00053]  (hidden comment: CAP-NONPOL)
C703  value 4.7uF  [AP1-00117]  (hidden comment: CAP-NONPOL)
C704  value 100nF  [AP1-00053]  (hidden comment: CAP-NONPOL)
C705  value 1n  [AP1-00053]  (hidden comment: CAP-NONPOL)
C706  value 150p  [AP1-00053]  (hidden comment: CAP-NONPOL)
L700  INDUCTOR  value BLM15BB221SN1  [AP3-00028]
L701  value BLM15BB221SN1  [AP3-00028]  (hidden comment: INDUCTOR)
Q700  MOSFET_P_GSD  value IRLML6402  [AP5-00002]
Q701  MOSFET_N_GSD  value BSS138N  [AP5-00002]
R700  value 0.1R  [AP2-00076]  (hidden comment: R2)
R701  value 100k  [AP2-00011]  (hidden comment: R2)
R702  value 100R  [AP2-00076]  (hidden comment: R2)
R703  value 10k  [AP2-00011]  (hidden comment: R2)
R704  value 100R  [AP2-00076]  (hidden comment: R2)
R705  value 680R  [AP2-00011]  (hidden comment: R2)
R706  value 0R  [AP2-00011]  (hidden comment: R2)
R707  value 2k  [AP2-00076]  (hidden comment: R2)
R708  value 10k  [AP2-00011]  (hidden comment: R2)
R709  value 10k  [AP2-00011]  (hidden comment: R2)
U700  AD8656  [AP6-00100]  (parts A,B of 2)
U701  ADA4528-1  [AP6-00100]

### Blocks framed on the sheet
Active low pass filter with gain: C700-C702 L700 R703 R705 U700

### Ports
CURRENT_IN (in), CURRENT_OUT (out), HIGH_CURRENT_RANGE_DISABLE (in), HIGH_GAIN_OUTPUT (out), LOW_GAIN_OUTPUT (out)

### Nets
GND: C700.2 C701.2 C703.2 C704.2 C705.1 R705.1 R707.1 R709.1 U700.4(V-) U701.1(NIC) U701.4(V-) U701.5(NIC) U701.8(NIC)
VCC_CM_P3V3: L700.1
VCC_FILTER_P3V3: C700.1 C701.1 L700.2 U700.8(V+)
VCC_P5V0: L701.1
CM_PA05_AIN5: C706.2 R708.2 U700.7(OUTB) ; port LOW_GAIN_OUTPUT
CM_PA08_AIN16: C702.2 R703.2 U700.1(OUTA) ; port HIGH_GAIN_OUTPUT
CM_PA18_CMP0: Q700.1(G) R701.2 ; port HIGH_CURRENT_RANGE_DISABLE
VCC_P3V3_CM_IN: R700.1 R701.1 R702.1 R704.2 ; port CURRENT_IN
VCC_PRE_AMP_P5V0: C703.1 C704.1 L701.2 U701.7(V+)
NetC702_1: C702.1 R703.1 R705.2 U700.2(INA_-)
NetC705_2: C705.2 R706.1 U700.3(INA_+) U700.5(INB_+)
NetC706_1: C706.1 R708.1 R709.2 U700.6(INB_-)
NetQ500_2: Q700.3(D) R702.2 U701.2(IN-) ; port CURRENT_OUT
NetQ700_2: Q700.2(S) R700.2
NetQ701_1: Q701.1(G) U701.6(OUT)
NetQ701_2: Q701.2(S) R706.2 R707.2
NetQ701_3: Q701.3(D) R704.1 U701.3(IN+)

### Notes on the sheet
- Active low pass filter will reduce the  gain for undesired frequencies that are above the frequencies of interest.
  Cut-off frequency is 106 kHz
  fc = 1/(2*pi*10k*150pF)
  Gain = 16
- Low noise precision amplifier
  Gain = 20
- Active low pass filter with gain
- Active low pass filter will reduce the  gain for undesired frequencies that are above the frequencies of interest.
  Cut-off frequency is 106 kHz
  fc = 1/(2*pi*10k*150pF)
  Gain = 2
- Date:
- PAGE:
- of
- TITLE:
- Document number:
- Revision:

### Library data of the parts
C700 C704 = A01-0416: Ceramic capacitor, SMD 0402, High Density Footprint; PartGroup: Capacitors,Ceramic,SMD 0402; Tolerance: 50V, +/-0.25pF; TemperatureRange: -55 - +125 deg C; AN: A01-0416; Height: 0.550000011920929
C701 C703 = A01-0377: Ceramic capacitor, SMD 0603, X5R, 10V, 10% (de31036); PartGroup: Capacitors,Ceramic,SMD 0603; Manufacturer: tdk; MPN: C1608X5R1A475K; TemperatureRange: -55 - +85 deg C; AN: A01-0377; Tolerance: 10%; Height: 0.800000011920929
C702 C706 = A01-0028: Ceramic capacitor, SMD 0402, X7R, 50V, +/-10%; PartGroup: Capacitors,Ceramic,SMD 0402; TemperatureRange: -55 - +125 deg C; AN: A01-0028; Tolerance: 50V, +/-10%; Height: 0.550000011920929
C705 = A01-0038: as C606 on sheet SAML21_Xplained_Pro_current_measurement_control; AN: A01-0038; Tolerance: 50V, +/-10%; Height: 0.550000011920929
L700 L701 = A03-0037: SMD RF inductor 0402. Z=220Ohm (@100MHz), Max R(dc)=0.80Ohm, Max current=200mA; PartGroup: Inductors,EMI; Manufacturer: Murata; Tolerance: ±25%; TemperatureRange: -55°C to +125°C; AN: A03-0037; Height: 0.5; MPN: BLM15BB221SN1
Q700 = A05-0087: P-ch. MOSFET. -30V, -3.7A continuous,RDS(ON)=0.05Ohm@VGS=-4,5V, RDS(ON)=0.08Ohm@VGS=-2.5V; PartGroup: Transistors,Power FET,SMD; Manufacturer: International Rectifier; MPN: IRLML6402PBF; TemperatureRange: -55 - +150 deg C; AN: A05-0087; Height: 1.14999997615814
Q701 = A05-0140: as Q501 on sheet SAML21_Xplained_Pro_current_measurement; AN: A05-0140; Height: 1.10000002384186; MPN: BSS138N
R700 = A02-0896: WSL0603R1000FEA, metal strip resistor, 0.1 Ohm, +-1%, 0603 SMD, 1/10 W, TEMPCO +-75 ppm/Â°C; PartGroup: Resistors,Sense resistors,SMD Current Sense; Manufacturer: vishay; AN: A02-0896; Height: 0.330000013113022; MPN: WSL0603R1000FEA
R701 = A02-0260: as R500 on sheet SAML21_Xplained_Pro_current_measurement; AN: A02-0260; Tolerance: 1 %; Height: 0.349999994039536
R702 R704 = A02-0895: ERA-3YEB101V, metal film, 100R Â±0.1%, resistor in 0603 at 100mW, TEMPCO Â±25ppm/Â°C, Max V=75V; PartGroup: Resistors,Metal film,SMD Precision resistors; Manufacturer: Panasonic; MPN: ERA3YEB101V; AN: A02-0895; Height: 0.550000011920929
R703 R708 R709 = A02-0236: Thick film resistor, SMD 0402, 1/16W, 1%; PartGroup: Resistors,SMD,0402 1%; Manufacturer: vishay; MPN: CRCW040210K0FKED; TemperatureRange: -55 - +125 deg C; AN: A02-0236; Tolerance: 1 %; Height: 0.349999994039536
R705 = A02-0208: Thick film resistor, SMD 0402, 1/16W, 1%; PartGroup: Resistors,SMD,0402 1%; TemperatureRange: -55 - +125 deg C; AN: A02-0208; Tolerance: 1 %; Height: 0.349999994039536
R706 = A02-0163: as R600 on sheet SAML21_Xplained_Pro_current_measurement_control; AN: A02-0163; Height: 0.349999994039536
R707 = A02-0081: Thick film resistor, SMD 0603, 1/10W, 1%; PartGroup: Resistors,SMD,0603 1%; AN: A02-0081; Tolerance: 1 %; Height: 0.5
U700 = A06-1125: AD8656, dual low noise precision OpAmp, rail-to-rail, low offset 250uV, GBP 28 MHz, 8MSOP; PartGroup: Integrated Circuits,General linear,OP-AMP; Manufacturer: Analog Devices; MPN: AD8656ARMZ; TemperatureRange: -40 to +125 deg celcius; AN: A06-1125; Value: AD8656; Height: 1.10000002384186
U701 = A06-1134: Precision OpAmp, Zero-Drift 0.015uV/K, ultra low noise 5.6nV/sqrt(Hz), Vo=2uV, GBW=4MHz, single supply 2.2V to 5.5V or dual supply +-1V to +-2.75V, rail to rail, unity gain stable; PartGroup: Integrated Circuits,General linear,OP-AMP; Manufacturer: Analog Devices; MPN: ADA4528-1ARMZ; AN: A06-1134; Value: ADA4528-1; Height: 1.10000002384186

## Sheet SAML21_Xplained_Pro_SAML21_peripherals.SchDoc: Target MCU peripherals
size A3; Organization: ATMEL Norway; Address1: Vestre Rosten 79; Address2: N-7075 TILLER; Address3: NORWAY; DocumentNumber: A09-2241; Revision: 4; SheetNumber: 3; SheetTotal: 10; PageSetup: Record=PageOptions|CenterHorizontal=True|CenterVertical=True|PrintScale=1.01|XCorrection=1.00|YCorrection=1.00|PrintKind=1|BorderSize=5000000|LeftOffset=0|BottomOffset=0|Orientation=2|PaperLength=1000|PaperWidth=1000|Scale=100|PaperSource=7|PrintQuality=-4|MediaType=1|DitherType=10|PaperKind=A3 (297 x 420 mm)|PrintScaleMode=1
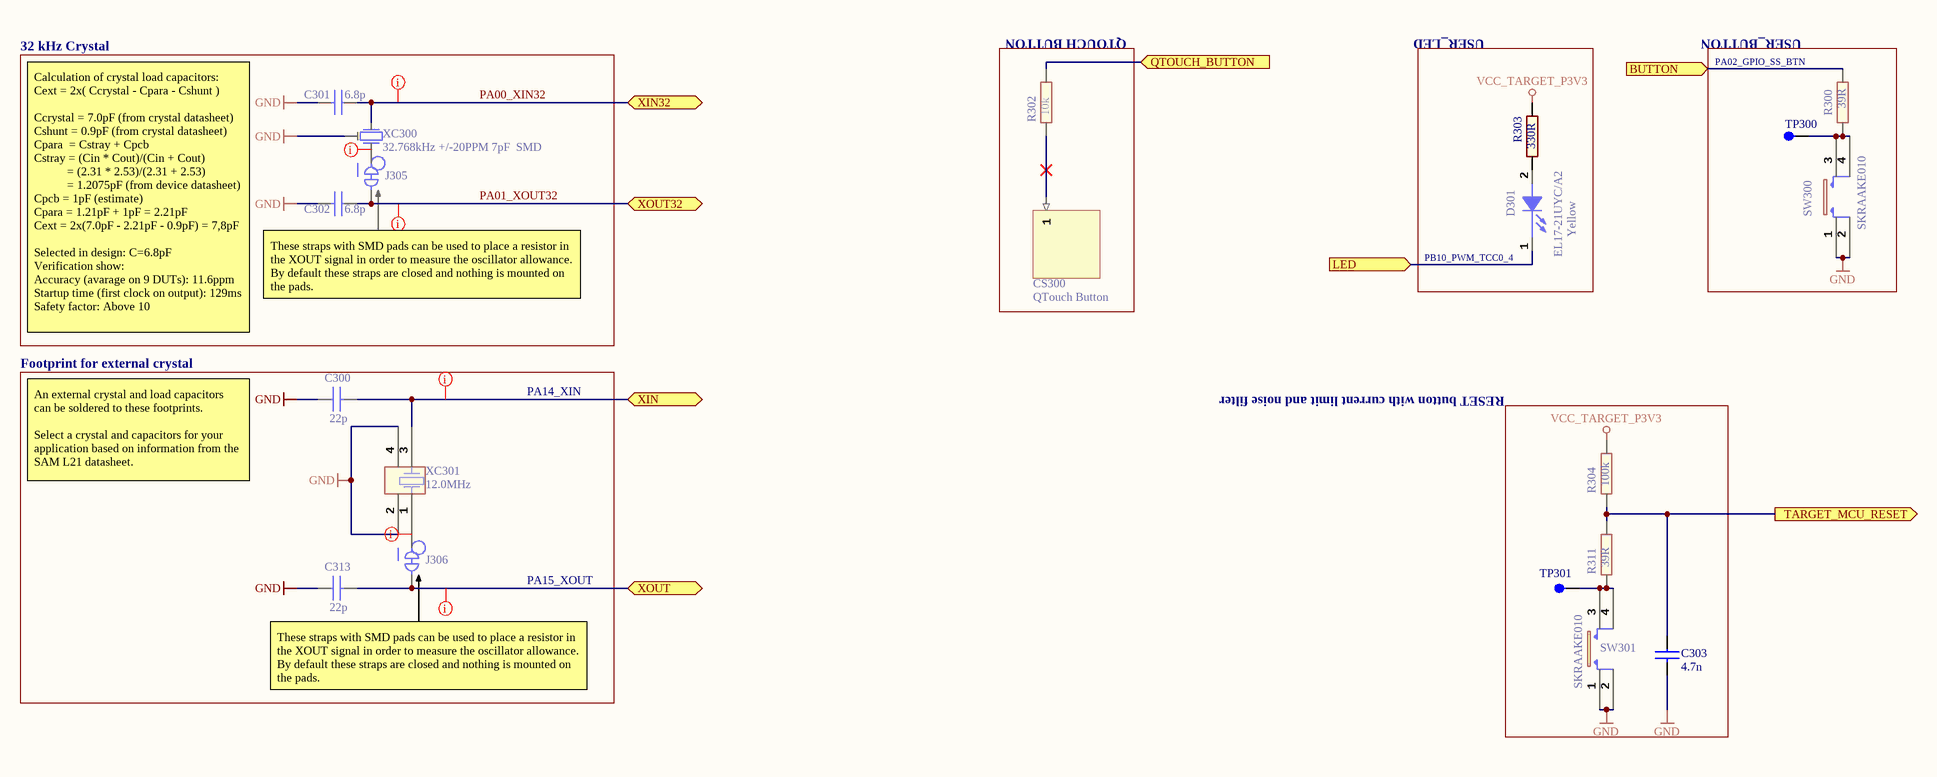
[diagram p9: SAML21_Xplained_Pro_SAML21_peripherals.SchDoc]

### Parts
C300  value 22p  [AP1-00001]  (hidden comment: CAP-NONPOL)
C301  value 6.8p  [AP1-00053]  (hidden comment: CAP-NONPOL)
C302  value 6.8p  [AP1-00053]  (hidden comment: CAP-NONPOL)
C303  value 4.7n  [AP1-00053]  (hidden comment: CAP-NONPOL)
C313  value 22p  [AP1-00001]  (hidden comment: CAP-NONPOL)
CS300  QTouch Button  (no BOM)
D301  Yellow  value EL17-21UYC/A2  [AP4-00013]
J305  (no value)  [AP9-00044]  (net tie, no BOM)
J306  (no value)  [AP9-00044]  (net tie, no BOM)
R300  value 39R  [AP2-00011]  (hidden comment: R2)
R302  value 10k  [AP2-00011]  (hidden comment: R2)
R303  value 330R  [AP2-00011]  (hidden comment: R2)
R304  value 100k  [AP2-00011]  (hidden comment: R2)
R311  value 39R  [AP2-00011]  (hidden comment: R2)
SW300  value SKRAAKE010  [AP8-00137]  (hidden comment: Can be ordered in low volumes from Mouser)
SW301  value SKRAAKE010  [AP8-00137]  (hidden comment: Can be ordered in low volumes from Mouser)
TP300  TESTPOINT  [AP8-00010]  (value not drawn)  (no BOM)
TP301  TESTPOINT  [AP8-00010]  (value not drawn)  (no BOM)
XC300  value 32.768kHz +/-20PPM 7pF  SMD  [AP7-00044]  (hidden comment: Farnell order no:1539364)
XC301  value 12.0MHz  [AP7-00039]  (hidden comment: CRYSTAL1324)

### Blocks framed on the sheet
32 kHz Crystal: C301 C302 J305 XC300
QTOUCH BUTTON: CS300 R302
USER_LED: D301 R303
USER_BUTTON: R300 SW300 TP300
Footprint for external crystal: C300 C313 J306 XC301
RESET button with current limit and noise filter: C303 R304 R311 SW301 TP301

### Ports
BUTTON (in), LED (in), QTOUCH_BUTTON (in), TARGET_MCU_RESET (out), XIN32 (bidir), XIN (bidir), XOUT32 (bidir), XOUT (bidir)

### Nets
GND: C300.1 C301.2 C302.2 C303.2 C313.1 SW300.1 SW300.2 SW301.1 SW301.2 XC300.3 XC301.2 XC301.4
VCC_TARGET_P3V3: R303.2 R304.2
PA00_XIN32: C301.1 XC300.2 ; port XIN32
PA01_XOUT32: C302.1 J305.2 ; port XOUT32
PA02_GPIO_SS_BTN: R300.2 ; port BUTTON
PA10_ADC18_PTCY8: R302.2 ; port QTOUCH_BUTTON
PA14: C300.2 XC301.3 ; port XIN
PA15: C313.2 J306.2 ; port XOUT
PB10_PWM_TCC0_4: D301.1(CATHODE) ; port LED
TARGET_MCU_RESET: C303.1 R304.1 R311.2 ; port TARGET_MCU_RESET
NetCS300_1: CS300.1 R302.1
NetD301_2: D301.2(ANODE) R303.1
NetJ305_1: J305.1 XC300.1
NetJ306_1: J306.1 XC301.1
NetR300_1: R300.1 SW300.3 SW300.4 TP300.1
NetR311_1: R311.1 SW301.3 SW301.4 TP301.1

### Layout directives
rule Assembly Testpoint Usage [Testpoint - Not Allowed    Multiple - Not Allowed]: NetJ305_1, NetJ306_1, PA00_XIN32, PA01_XOUT32, PA14, PA15

### Notes on the sheet
- PA02_GPIO_SS_BTN
- (near D301) PB10_PWM_TCC0_4
- Calculation of crystal load capacitors:
  Cext = 2x( Ccrystal - Cpara - Cshunt )
  Ccrystal = 7.0pF (from crystal datasheet)
  Cshunt = 0.9pF (from crystal datasheet)
  Cpara  = Cstray + Cpcb
  Cstray = (Cin * Cout)/(Cin + Cout)
  = (2.31 * 2.53)/(2.31 + 2.53)
  = 1.2075pF (from device datasheet)
  Cpcb = 1pF (estimate)
  Cpara = 1.21pF + 1pF = 2.21pF
  Cext = 2x(7.0pF - 2.21pF - 0.9pF) = 7,8pF
  Selected in design: C=6.8pF
  Verification show:
  Accuracy (avarage on 9 DUTs): 11.6ppm
  Startup time (first clock on output): 129ms
  Safety factor: Above 10
- These straps with SMD pads can be used to place a resistor in the XOUT signal in order to measure the oscillator allowance.
  By default these straps are closed and nothing is mounted on the pads.
- PA14_XIN
- An external crystal and load capacitors can be soldered to these footprints.
  Select a crystal and capacitors for your application based on information from the SAM L21 datasheet.
- PA15_XOUT
- Date:
- PAGE:
- of
- TITLE:
- Document number:
- Revision:

### Library data of the parts
C300 C313 = A01-0019: Ceramic capacitor, SMD 0402, NP0, 50V, +/-5%; PartGroup: Capacitors,Ceramic,SMD 0402; TemperatureRange: -55 - +125 deg C; AN: A01-0019; Tolerance: 50V, +/-5%; Height: 0,550000011920929
C301 C302 = A01-0013: Ceramic capacitor, SMD 0402, NP0, 50V, +/-5%; PartGroup: Capacitors,Ceramic,SMD 0402; TemperatureRange: -55 - +125 deg C; AN: A01-0013; Tolerance: 50V, +/-5%; Height: 0,550000011920929
C303 = A01-0046: Ceramic capacitor, SMD 0402, X7R, 25V, +/-10% (de35287); PartGroup: Capacitors,Ceramic,SMD 0402; TemperatureRange: -55 - +125 deg C; AN: A01-0046; Tolerance: 25V, +/-10%; Height: 0.550000011920929
CS300 = QTouchButton: ConfiguratorName: ATMEL_TOUCH; ConfigurationParameters: {}__sensorid[1]{}width[8]{}height[8]{}
D301 = A10-0019: LED, Yellow, Wave length=591nm, SMD 0805, ±70°; PartGroup: Opto,LEDs,SMD; Manufacturer: Everlight; MPN: 17-21UYC/S530-A3/TR8; TemperatureRange: -40 to +85 deg C; AN: A10-0019; Height: 1,10000002384186
J305 J306 = A09-0783: Default closed SMD strap, 0603 size; PartGroup: Mechanical devices,PCB implemented components; Value: SMD-STRAP_0603_CLOSED; AN: A09-0783; Height: 0
R300 R311 = A02-0178: as R803 on sheet SAML21_Xplained_Pro_current_measurement_calibration; AN: A02-0178; Tolerance: 1 %; Height: 0,349999994039536
R302 = A02-0236: as R703 on sheet SAML21_Xplained_Pro_current_measurement_frontend; AN: A02-0236; Tolerance: 1 %; Height: 0,349999994039536
R303 = A02-0200: Thick film resistor, SMD 0402, 1/16W, 1%; PartGroup: Resistors,SMD,0402 1%; TemperatureRange: -55 - +125 deg C; AN: A02-0200; Tolerance: 1 %; Height: 0.349999994039536
R304 = A02-0260: Thick film resistor, SMD 0402, 1/16W, 1%; PartGroup: Resistors,SMD,0402 1%; TemperatureRange: -55 - +125 deg C; AN: A02-0260; Tolerance: 1 %; Height: 0,349999994039536
SW300 SW301 = A08-0790: 6.2x6.2 mm SMD tact switch, same as A08-0091 but less force is needed; PartGroup: Mechanical devices,Switches,SMD; Manufacturer: ALPS; TemperatureRange: -30 - +90 deg C; AN: A08-0790; Height: 5,09999990463257; MPN: SKRAAKE010
TP300 TP301 = A08-0004: Single SMD testpad; PartGroup: Mechanical devices,Connectors,Test points; AN: A08-0004; Value: TESTPAD; Height: 0
XC300 = A07-0052: 32k768 crystal, +-20ppm, CL=7pF, max ESR 60kOhm, SMD; PartGroup: Frequency devices,Crystals,SMD; Manufacturer: Micro Crystal; MPN: MS1V-T1K 32.768kHz 7pF +/-20PPM TA; Tolerance: +/- 20 PPM; TemperatureRange: -40 /+85; AN: A07-0052; Height: 2.07999992370605
XC301 = A07-0042: Fox FQ5032B 12.0MHz SMD crystal 738B-12; PartGroup: Frequency devices,Crystals,SMD; Manufacturer: Fox  Electronics; MPN: FQ5032B-12-C-C-C-200-1 / 738B-12; Tolerance: 30PPM; AN: A07-0042; Height: 1.20000004768372